# Altium project LM303AGR_breakout.PrjPcb
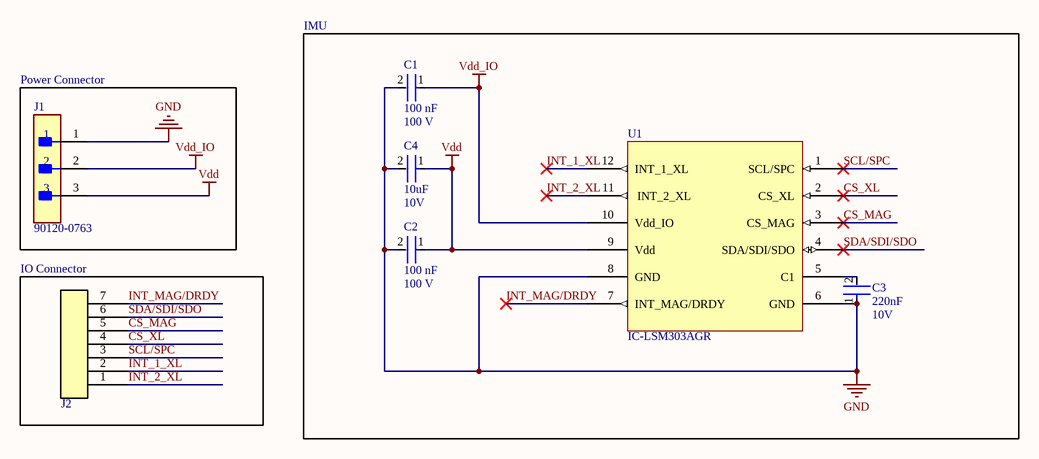
[diagram p0: schematic.SchDoc]
1 sheet, 7 parts. Net scope: global (net labels, ports and power ports of the same name join across sheets).
Board file: PCB1.PcbDoc

## Sheet schematic.SchDoc
size A; SheetNumber: 1; SheetTotal: 1

### Parts
C1  Capacitance: 100 nF  Voltage: 100 V  [CAP-0603]  (hidden comment: CC0603KRX7R0BB104)
C2  Capacitance: 100 nF  Voltage: 100 V  [CAP-0603]  (hidden comment: CC0603KRX7R0BB104)
C3  Capacitance: 220nF  Voltage: 10V  [CAP-0603]  (hidden comment: CC0402KRX5R6BB224)
C4  Capacitance: 10uF  Voltage: 10V  [CAP-0603]  (hidden comment: CC0805ZKY5V6BB106)
J1  90120-0763  [FP-90120-0763-MFG]
J2  61300311121  [CONN_PH1-07-UA_ADM]  (value not drawn)
U1  IC-LSM303AGR  [SON_03AGRTR_STM-M]

### Blocks framed on the sheet
IMU: C1-C4 U1
Power Connector: J1
IO Connector: J2

### Nets
GND: C1.2 C2.2 C3.1 C4.2 J1.1 U1.6(GND) U1.8(GND)
Vdd: C2.1 C4.1 J1.3 U1.9(Vdd)
Vdd_IO: C1.1 J1.2 U1.10(Vdd_IO)
CS_MAG: J2.5 U1.3(CS_MAG)
CS_XL: J2.4 U1.2(CS_XL)
INT_1_XL: J2.2 U1.12(INT_1_XL)
INT_2_XL: J2.1 U1.11(INT_2_XL)
INT_MAG/DRDY: J2.7 U1.7(INT_MAG/DRDY)
SCL/SPC: J2.3 U1.1(SCL/SPC)
SDA/SDI/SDO: J2.6 U1.4(SDA/SDI/SDO)
NetC3_2: C3.2 U1.5(C1)

### Library data of the parts
C1 C2 = CAP-100N-0001: CAP CER 0.1UF 100V X7R 0603; Device Class: Ceramic; Size: 0603; ComponentLink1Description: Datasheet; ComponentLink1URL: https://www.yageo.com/upload/media/product/app/datasheet/mlcc/upy-np0x7r_mv_100-to-630v.pdf
C3 = CAP-220nF-0001: CAP CER 0.22UF 10V X5R 0603; Device Class: Ceramic; Size: 1206; ComponentLink1Description: Datasheet; ComponentLink1URL: https://www.yageo.com/upload/media/product/productsearch/datasheet/mlcc/UPY-GPHC_X7R_6.3V-to-250V_24.pdf
C4 = CAP-10uF-0001: CAP CER 10UF 10V Y5V 0603; Device Class: Ceramic; Size: 1206; ComponentLink1Description: Datasheet; ComponentLink1URL: https://www.yageo.com/upload/media/product/productsearch/datasheet/mlcc/UPY-GPHC_X7R_6.3V-to-250V_24.pdf
J1 = CMP-04776-000084-1: CONN HEADER VERT 3POS 2.54MM; Manufacturer: Molex; Voltage Rating: 350V; Number Of Contacts: 3; Conn Orientation: Vertical; Current Rating: 3A; Conn Gender: Male; Package: 90120-0763; ComponentLink2Description: Datasheet; Height: 5.8mm; Manufacturer Part Number: 90120-0763; Temperature Range High: +125°C; RoHS: TRUE; ComponentLink2URL: https://www.molex.com/webdocs/datasheets/pdf/en-us/0901200763_PCB_HEADERS.pdf; Device Class L2: Headers and Wire Housings; Temperature: -55°C to +125°C; Device Class L1: Connectors; Pitch: 2.54mm; Footprint Url: https://www.molex.com/pdm_docs/sd/901200763_sd.pdf; Device Class L3: unset; Temperature Range Low: -55°C; Number Of Rows: 1; Category: Conn; Lead Free: Yes; Mouser Description: Board-To-Board Connector, C-Grid III 90120 Series, Through Hole, Header, 3, 2.54 mm; Octopart: https://octopart.com/90120-0763-molex-655433; Contact Material: Gold,Nickel; Automotive: No; Digikey Description: CONN HEADER VERT 3POS 2.54MM
J2 = CONN-7POS-0001: CONN HEADER R/A 7POS 3MM; Current Rating: 3A; Voltage Rating: 250V; ComponentLink1Description: Datasheet; ComponentLink1URL: https://www.we-online.com/components/products/datasheet/61300311121.pdf
U1 = IC-LSM303AGR: Accelerometer, Magnetometer, Temperature, 6 Axis Sensor I2C, SPI Output